# EAGLE design boost_regulator_MIC2288 (EAGLE 9.6.2)
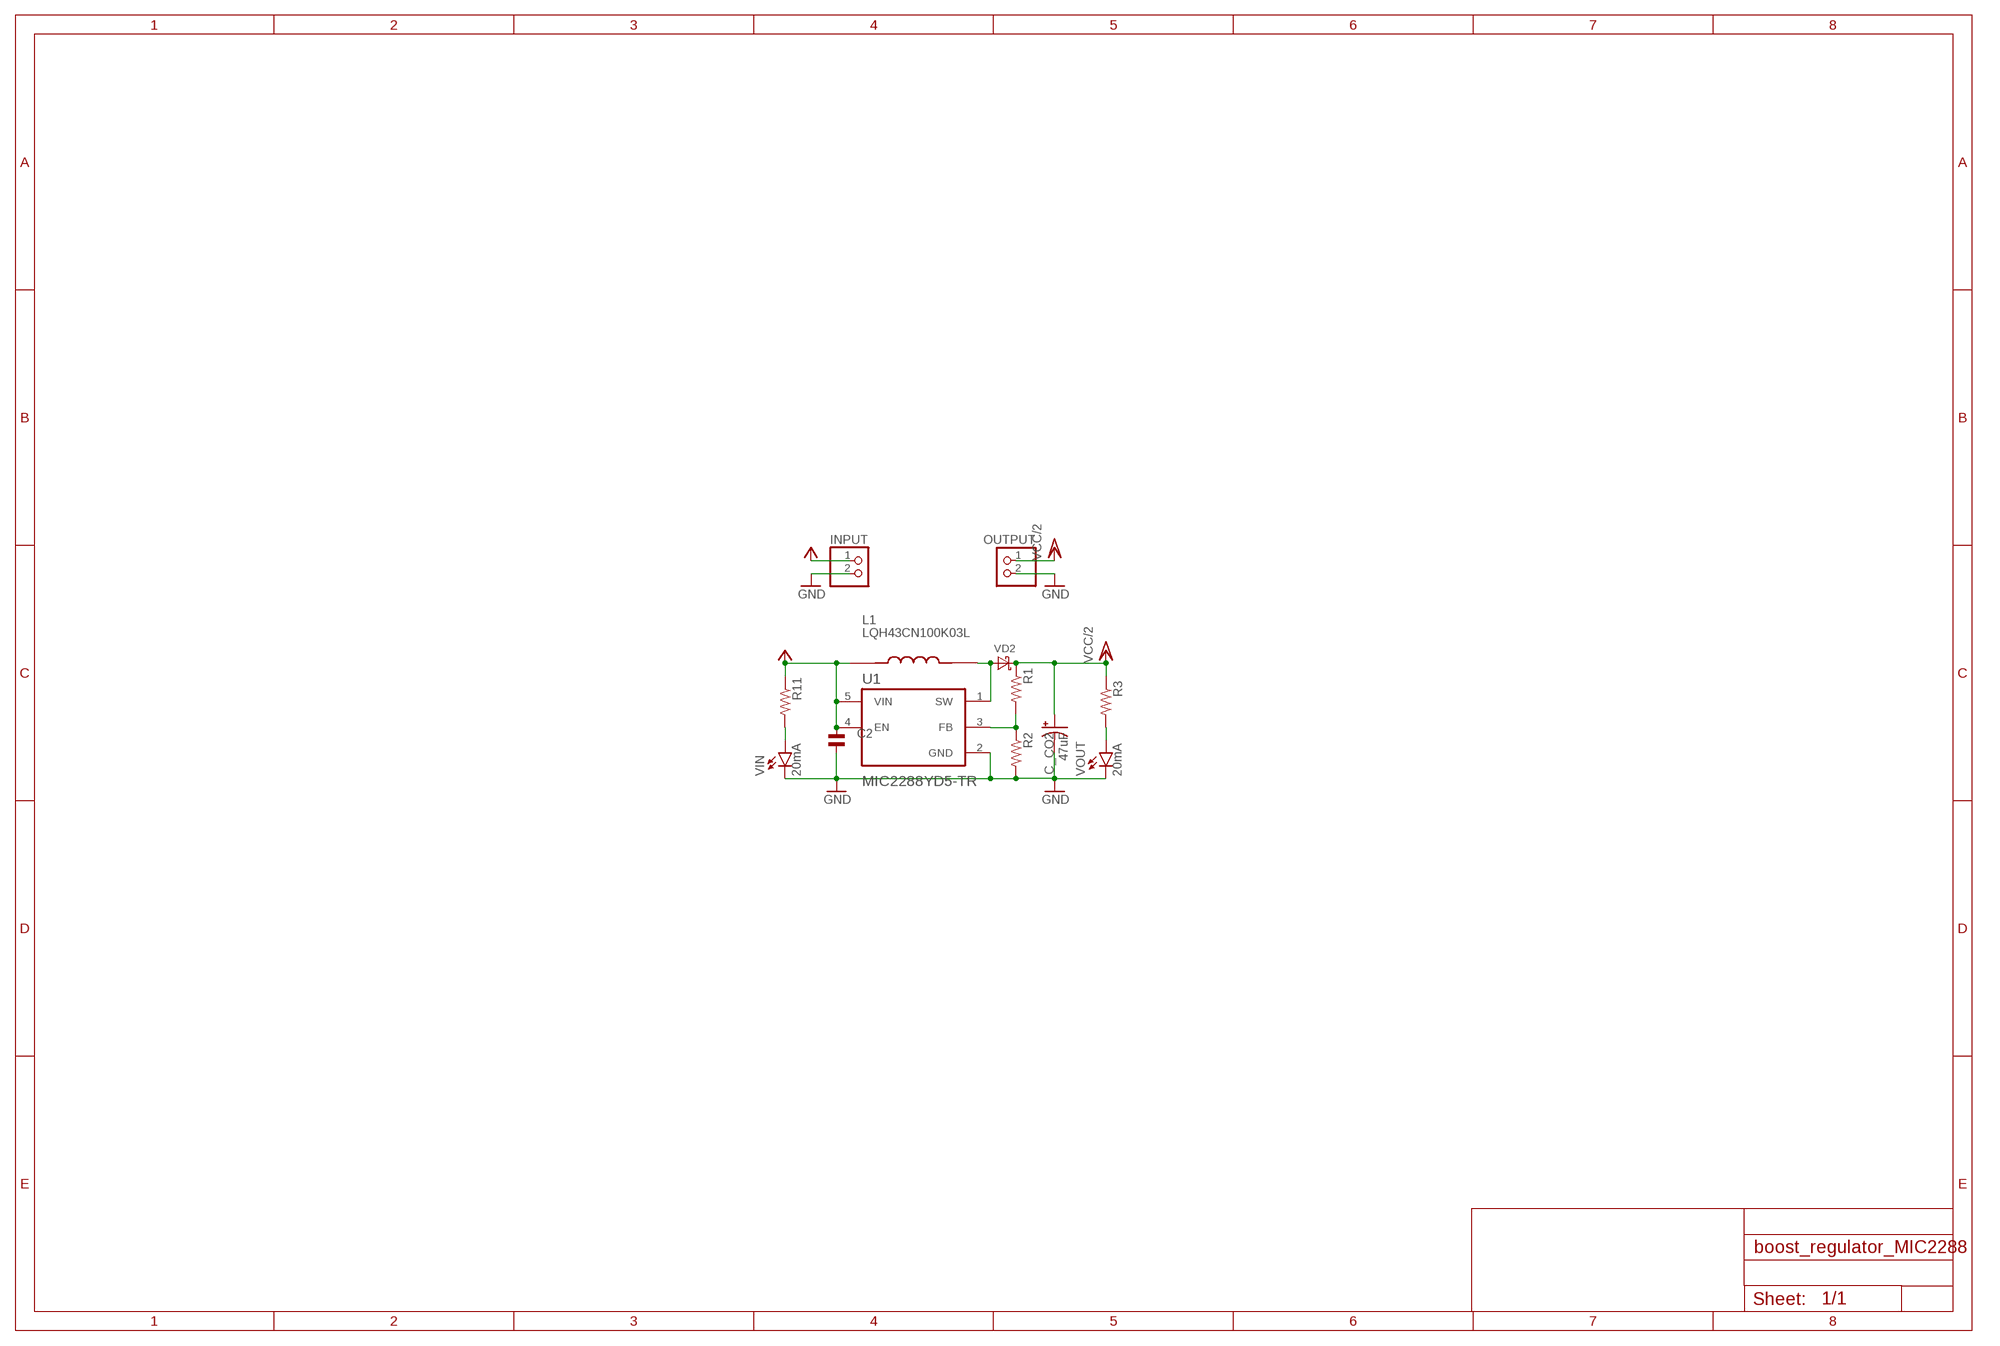
[diagram p0: schematic, sheet 1]

## Parts
C2  10uF  RC-MASTER-SMD_C_0603MP  [RC-MASTER-SMD_C0603MP]
C_CO2  47uF  22UF-POLAR-PANASONIC_C-35V-20%  [PANASONIC_C]
INPUT  PINHD-1X2  [1X02]
L1  LQH43CN100K03L  [IND_LQH43CN100K03L]
OUTPUT  PINHD-1X2  [1X02]
R1  47K  RC-MASTER-SMD_R_0603MP  [RC-MASTER-SMD_R0603MP]
R2  5K1  RC-MASTER-SMD_R_0603MP  [RC-MASTER-SMD_R0603MP]
R3  1K  RC-MASTER-SMD_R_0603MP  [RC-MASTER-SMD_R0603MP]
R11  100R  RC-MASTER-SMD_R_0603MP  [RC-MASTER-SMD_R0603MP]
U1  MIC2288YD5-TR  [SOT95P280X100-5N]
VD2  DIODE-SCHOTTKY-SOD123  [SOD123]
VIN  20mA  LEDCHIP-LED0603  [CHIP-LED0603]
VOUT  20mA  LEDCHIP-LED0603  [CHIP-LED0603]

## Nets
ACTIVITY: R11.2 VIN.A
ACTIVITY1: R3.2 VOUT.A
GND: C2.2 C_CO2.- INPUT.2 OUTPUT.2 R2.2 U1.2(GND) VIN.C VOUT.C
N$1: L1.2 U1.1(SW) VD2.A
N$3: R1.2 R2.1 U1.3(FB)
VCC: C2.1 INPUT.1 L1.1 R11.1 U1.4(EN) U1.5(VIN)
VCC/2: C_CO2.+ OUTPUT.1 R1.1 R3.1 VD2.C

## Library data of the parts
C2 = 52101-101-REV-A:RC-MASTER-SMD_C_: NON-POLARIZED CAP
C_CO2 = SparkFun-Capacitors:22UF-POLAR: 22µF polarized capacitors A capacitor is a passive two-terminal electrical component used to store electrical energy temporarily in an electric field.; PROD_ID: CAP-08618
INPUT OUTPUT = pinhead:PINHD-1X2: PIN HEADER
L1 = LQH43CN100K03L:LQH43CN100K03L: Inductor Power Chip Unshielded Wirewound 10uH 10% 1MHz Ferrite 650mA 240mOhm DCR 1812 T/R Check prices <https://pricing.snapeda.com/search/part/LQH43CN100K03L/?ref=eda>; AVAILABILITY: Good; DESCRIPTION: Inductor with Inductance: 10uH Tol. +/-10%, Package: 1812 (4532); MF: Murata; MP: LQH43CN100K03L; PACKAGE: NONSTANDARD; PRICE: None; PURCHASE-URL: https://pricing.snapeda.com/search/part/LQH43CN100K03L/?ref=eda
R1-R3 R11 = 52101-101-REV-A:RC-MASTER-SMD_R_: RESISTOR
U1 = MIC2288YD5-TR:MIC2288YD5-TR: Boost Switching Regulator IC Positive Adjustable 2.5V 1 Output 1.2A (Switch) SOT-23-5 Thin, TSOT-23-5; AVAILABILITY: Unavailable; DESCRIPTION: IC REG BOOST ADJ 1.2A TSOT23-5; MF: Microchip Technology; MP: MIC2288YD5-TR; PACKAGE: None; PRICE: None
VD2 = diode:DIODE-SCHOTTKY-: SCHOTTKY DIODE
VIN VOUT = led:LED: LED OSRAM: - CHIPLED LG R971, LG N971, LY N971, LG Q971, LY Q971, LO R971, LY R971 LH N974, LH R974 LS Q976, LO Q976, LY Q976 LO Q996 - Hyper CHIPLED LW Q18S LB Q993, LB Q99A, LB R99A - SideLED LS A670, LO A670, LY A670, LG A670, LP A670 LB A673, LV A673, LT A673, LW A673 LH A674 LY A675 LS A676, LA A676, LO A676, LY A676, LW A676 LS A679, LY A679, LG A679 - Hyper Micro SIDELED® LS Y876, LA Y876, LO Y876, LY Y876 LT Y87S - SmartLED LW L88C, LW L88S LB L89C, LB L89S, LG L890 LS L89K, LO L89K, LY L89K LS L896, LA L896, LO L896, LY L896 - TOPLED LS T670, LO T670, LY T670, LG T670, LP T670 LSG T670, LSP T670, LSY T670, LOP T670, LYG T670 LG T671, LOG T671, LSG T671 LB T673, LV T673, LT T673, LW T673 LH T674 LS T676, LA T676, LO T676, LY T676, LB T676, LH T676, LSB T676, LW T676 LB T67C, LV T67C, LT T67C, LS T67K, LO T67K, LY T67K, LW E67C LS E67B, LA E67B, LO E67B, LY E67B, LB E67C, LV E67C, LT E67C LW T67C LS T679, LY T679, LG T679 LS T770, LO T770, LY T770, LG T770, LP T770 LB T773, LV T773, LT T773, LW T773 LH T774 LS E675, LA E675, LY E675, LS T675 LS T776, LA T776, LO T776, LY T776, LB T776 LHGB T686 LT T68C, LB T68C - Hyper Mini TOPLED® LB M676 - Mini TOPLED Santana® LG M470 LS M47K, LO M47K, LY M47K Source: http://www.osram.convergy.de LUXEON: - LUMILED® LXK2-PW12-R00, LXK2-PW12-S00, LXK2-PW14-U00, LXK2-PW14-V00 LXK2-PM12-R00, LXK2-PM12-S00, LXK2-PM14-U00 LXK2-PE12-Q00, LXK2-PE12-R00, LXK2-PE12-S00, LXK2-PE14-T00, LXK2-PE14-U00 LXK2-PB12-K00, LXK2-PB12-L00, LXK2-PB12-M00, LXK2-PB14-N00, LXK2-PB14-P00, LXK2-PB14-Q00 LXK2-PR12-L00, LXK2-PR12-M00, LXK2-PR14-Q00, LXK2-PR14-R00 LXK2-PD12-Q00, LXK2-PD12-R00, LXK2-PD12-S00 LXK2-PH12-R00, LXK2-PH12-S00 LXK2-PL12-P00, LXK2-PL12-Q00, LXK2-PL12-R00 Source: www.luxeon.com KINGBRIGHT: KA-3528ASYC Source: www.kingbright.com

## Board
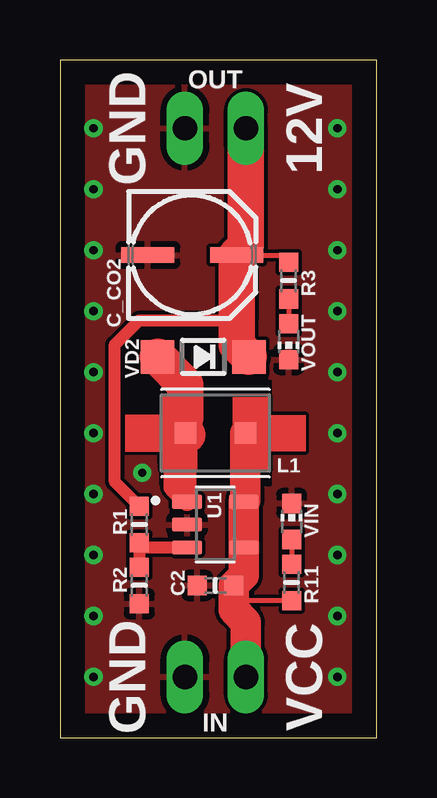
[diagram p1: board, top side]
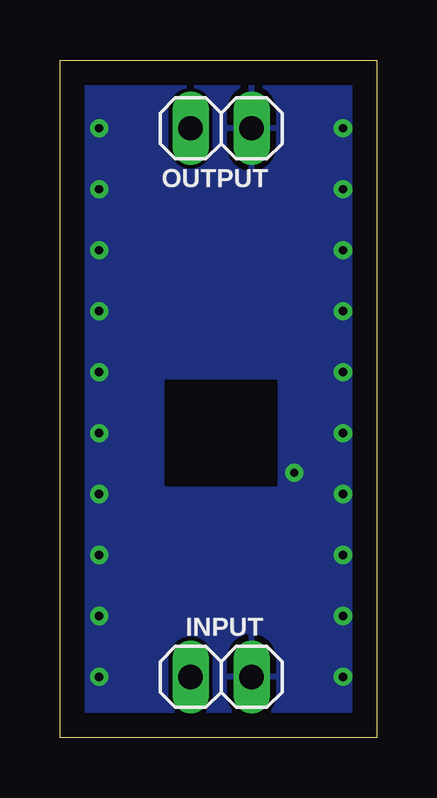
[diagram p2: board, bottom side, seen from below]

Size 13.19 x 28.25 mm. Coordinates in mm from the lower left corner, seen from the top.
Outline: 0,0 13.19,0 13.19,28.25 0,28.25 0,0
Copper layers (1*16): Top 0.035mm / dielectric 1.5mm / Bottom 0.035mm
Design rules "default": minimum track width 6mil, minimum drill 0.35mm, track to track 6mil, track to pad 6mil, pad to pad 6mil, via to via 6mil, smd to smd 6mil, copper to edge 40mil, drill to drill 6mil, minimum pad ring 10mil, minimum via ring 8mil, stop-mask expansion 4mil, vias tented up to drill 0mil, thermal gap 10mil

### Footprints (pad centres in the part's own frame; a part is rotated, then mirrored left to right if it is on the bottom)
RC-MASTER-SMD_C0603MP = smd 0.8 x 0.8: 1 -0.762,0; 2 0.762,0
PANASONIC_C = smd 2.2 x 0.65: + 1.9,-0.2; - -1.8,-0.2
1X02 = drill 1.016 long: 1 -1.27,0; 2 1.27,0
IND_LQH43CN100K03L = smd 0.9 x 0.9: 1 -1.25,0; 2 1.25,0
RC-MASTER-SMD_R0603MP = smd 0.8 x 0.8: 1 -0.762,0; 2 0.762,0
SOT95P280X100-5N = smd 1.24 x 0.59: 1 -1.185,0.95; 2 -1.185,0; 3 -1.185,-0.95; 4 1.185,-0.95; 5 1.185,0.95
SOD123 = smd 1.4 x 1.4: A 1.905,0; C -1.905,0
CHIP-LED0603 = smd 0.8 x 0.8: A 0,-0.75; C 0,0.75

### Placement (x,y rotation side)
C2  6.48,6.35 180 top
C_CO2  5.46,20.32 0 top
INPUT  6.48,2.54 0 bottom
L1  6.48,12.7 180 top
OUTPUT  6.48,25.4 0 bottom
R1  3.3,8.89 270 top
R2  3.3,6.35 270 top
R3  9.53,19.05 270 top
R11  9.65,6.48 90 top
U1  6.48,8.89 0 top
VD2  5.97,15.88 180 top
VIN  9.65,9.02 0 top
VOUT  9.53,16.51 180 top

### Tracks (layer width: path | path; a pad name or v marks a point on that pad's centre or on a via)
ACTIVITY
  Top 0.203: VIN.A R11.2
ACTIVITY1
  Top 0.203: R3.2 VOUT.A
GND  (via drill 0.35)
  other vias: 11.56,25.4 11.56,22.86 11.56,20.32 11.56,17.78 11.56,15.24 11.56,12.7 11.56,10.16 11.56,7.62 11.56,5.08 11.56,2.54 1.4,25.4 1.4,22.86 1.4,20.32 1.4,17.78 1.4,15.24 1.4,12.7 1.4,10.16 1.4,7.62 1.4,5.08 1.4,2.54 3.43,11.05
  pour Top: -1.27,29.21 13.84,29.21 13.84,-1.27 -1.27,-1.27
  pour Bottom: -1.27,29.21 13.84,29.21 13.84,-1.27 -1.27,-1.27
  cutout Top: 4.19,14.86 4.19,10.54 8.76,10.54 8.76,14.86
  cutout Bottom: 4.19,14.86 4.19,10.54 8.76,10.54 8.76,14.86
N$1
  Top 0.762: 5.29,12.63 U1.1 4.7,10.43 4.7,11.43 4.57,11.56 4.57,12.68 5.23,13.34
  Top 1.143: 5.23,13.34 L1.2
  Top 1.524: VD2.A 5.23,14.71 5.23,13.34 | 5.29,12.63 L1.2
N$3
  Top 0.508: R2.1 R1.2 3.49,7.94 U1.3
VCC
  Top 0.203: R11.1 7.87,5.71 C2.1
  Top 0.762: 7.73,9.9 U1.5
  Top 1.27: L1.1 7.73,9.9 | U1.5 U1.4 7.66,6.77 C2.1 7.24,5.33 7.75,4.83 INPUT.1
VCC/2
  Top 0.203: C_CO2.+ 9.22,20.12 R3.1
  Top 0.508: R1.1 2.29,10.67 2.29,16.38 3.3,17.4 7.36,17.4
  Top 1.524: OUTPUT.1 7.75,20.51 C_CO2.+ 7.36,17.4 7.36,16.39 VD2.C

### Text on the board
tPlace: OUT | GND | 12V | GND | VCC | IN